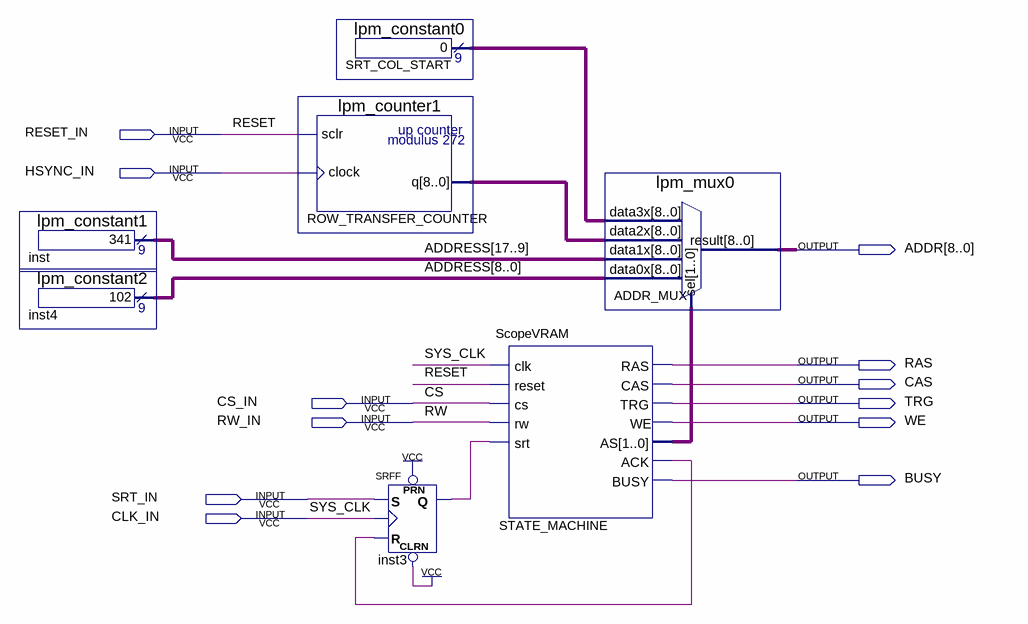
[diagram p0: schematic sheet]
// Quartus schematic oscilloscope-vram-test.bdf as structural Verilog: 7 symbols, 12 pins
module \oscilloscope-vram-test  (
  input  RESET_IN,
  input  HSYNC_IN,
  input  CS_IN,
  input  RW_IN,
  input  SRT_IN,
  input  CLK_IN,
  output [8:0] ADDR,
  output RAS,
  output CAS,
  output TRG,
  output WE,
  output BUSY
);

  wire inst3_q, STATE_MACHINE_ack;
  wire [1:0] STATE_MACHINE_as;
  wire [8:0] ROW_TRANSFER_COUNTER_q, SRT_COL_START_result;
  wire [17:0] ADDRESS;

  lpm_constant1 inst (.result(ADDRESS[17:9]));
  lpm_constant2 inst4 (.result(ADDRESS[8:0]));
  lpm_counter1 ROW_TRANSFER_COUNTER (.sclr(RESET_IN), .clock(HSYNC_IN), .q(ROW_TRANSFER_COUNTER_q));
  lpm_constant0 SRT_COL_START (.result(SRT_COL_START_result));
  SRFF inst3 (.PRN(1'b1), .CLRN(1'b1), .S(SRT_IN), .R(STATE_MACHINE_ack), .CLK(CLK_IN), .Q(inst3_q));
  ScopeVRAM STATE_MACHINE (
    .clk(CLK_IN), .reset(RESET_IN), .cs(CS_IN), .rw(RW_IN), .srt(inst3_q), .RAS(RAS), .CAS(CAS), .TRG(TRG),
    .WE(WE), .AS(STATE_MACHINE_as), .ACK(STATE_MACHINE_ack), .BUSY(BUSY));
  lpm_mux0 ADDR_MUX (
    .data3x(SRT_COL_START_result), .data2x(ROW_TRANSFER_COUNTER_q), .data1x(ADDRESS[17:9]),
    .data0x(ADDRESS[8:0]), .sel(STATE_MACHINE_as), .result(ADDR));

  // Other names for the same wires on the sheet: CS = CS_IN; RESET = RESET_IN; RW = RW_IN; SYS_CLK = CLK_IN
endmodule
